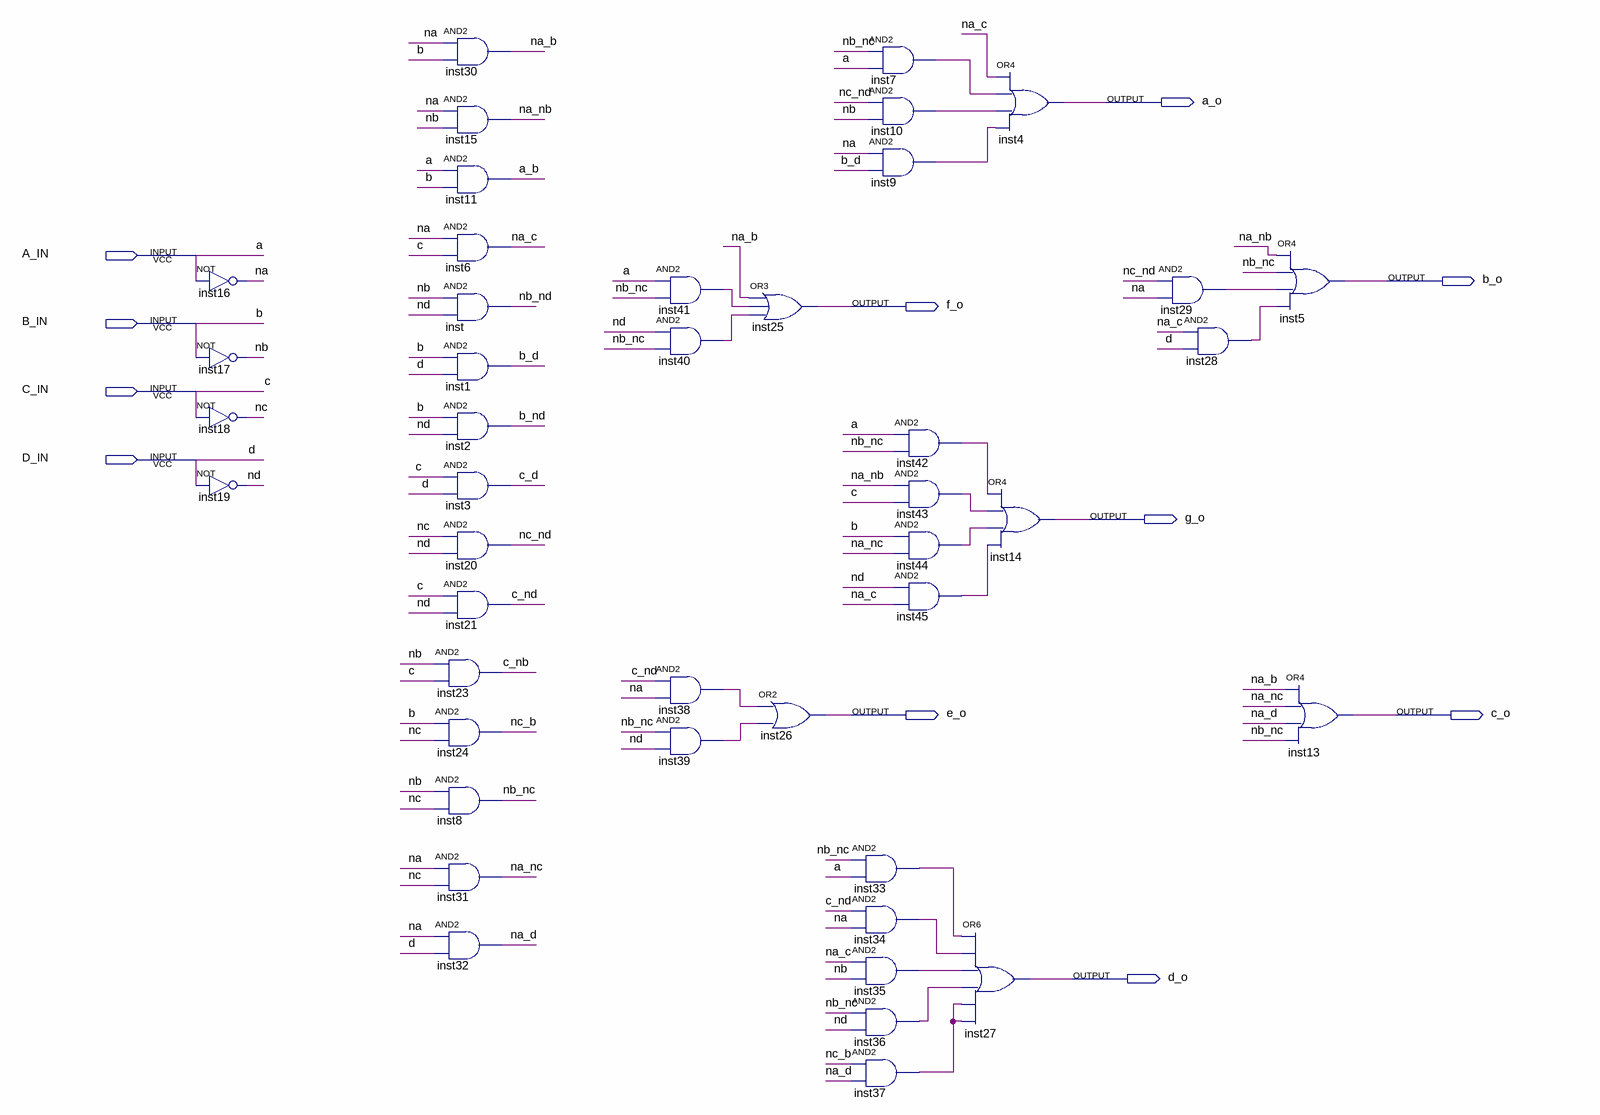
[diagram p0: schematic sheet]
// Quartus schematic decod_bsd_7seg.bdf as structural Verilog: 44 symbols, 11 pins
module decod_bsd_7seg (
  input  A_IN,
  input  B_IN,
  input  C_IN,
  input  D_IN,
  output a_o,
  output b_o,
  output f_o,
  output g_o,
  output e_o,
  output c_o,
  output d_o
);

  wire a_b, b_d, b_nd, c_d, c_nb, c_nd, inst7_out, inst9_out, inst10_out, inst28_out, inst29_out, inst33_out,
       inst34_out, inst35_out, inst36_out, inst37_out, inst38_out, inst39_out, inst40_out, inst41_out,
       inst42_out, inst43_out, inst44_out, inst45_out, na, na_b, na_c, na_d, na_nb, na_nc, nb, nb_nc, nb_nd,
       nc, nc_b, nc_nd, nd;

  not inst16 (na, A_IN);
  not inst17 (nb, B_IN);
  not inst18 (nc, C_IN);
  not inst19 (nd, D_IN);
  and inst30 (na_b, na, B_IN);
  and inst15 (na_nb, na, nb);
  and inst11 (a_b, A_IN, B_IN);
  and inst6 (na_c, na, C_IN);
  and inst (nb_nd, nb, nd);
  and inst1 (b_d, B_IN, D_IN);
  and inst2 (b_nd, B_IN, nd);
  and inst3 (c_d, C_IN, D_IN);
  and inst20 (nc_nd, nc, nd);
  and inst21 (c_nd, C_IN, nd);
  and inst23 (c_nb, nb, C_IN);
  and inst24 (nc_b, B_IN, nc);
  and inst8 (nb_nc, nb, nc);
  and inst31 (na_nc, na, nc);
  and inst32 (na_d, na, D_IN);
  and inst41 (inst41_out, A_IN, nb_nc);
  and inst40 (inst40_out, nd, nb_nc);
  and inst38 (inst38_out, c_nd, na);
  and inst39 (inst39_out, nb_nc, nd);
  or inst25 (f_o, na_b, inst41_out, inst40_out);
  or inst26 (e_o, inst38_out, inst39_out);
  and inst7 (inst7_out, nb_nc, A_IN);
  and inst10 (inst10_out, nc_nd, nb);
  and inst9 (inst9_out, na, b_d);
  and inst33 (inst33_out, nb_nc, A_IN);
  and inst34 (inst34_out, c_nd, na);
  and inst35 (inst35_out, na_c, nb);
  and inst36 (inst36_out, nb_nc, nd);
  and inst37 (inst37_out, nc_b, na_d);
  and inst42 (inst42_out, A_IN, nb_nc);
  and inst43 (inst43_out, na_nb, C_IN);
  and inst44 (inst44_out, B_IN, na_nc);
  and inst45 (inst45_out, nd, na_c);
  or inst4 (a_o, na_c, inst7_out, inst10_out, inst9_out);
  or inst14 (g_o, inst42_out, inst43_out, inst44_out, inst45_out);
  or inst27 (d_o, inst33_out, inst34_out, inst35_out, inst36_out, inst37_out, inst37_out);
  and inst29 (inst29_out, nc_nd, na);
  and inst28 (inst28_out, na_c, D_IN);
  or inst5 (b_o, na_nb, nb_nc, inst29_out, inst28_out);
  or inst13 (c_o, na_b, na_nc, na_d, nb_nc);

  // Other names for the same wires on the sheet: a = A_IN; b = B_IN; c = C_IN; d = D_IN
endmodule
